# EAGLE design Composite Board (EAGLE 9.1.3)
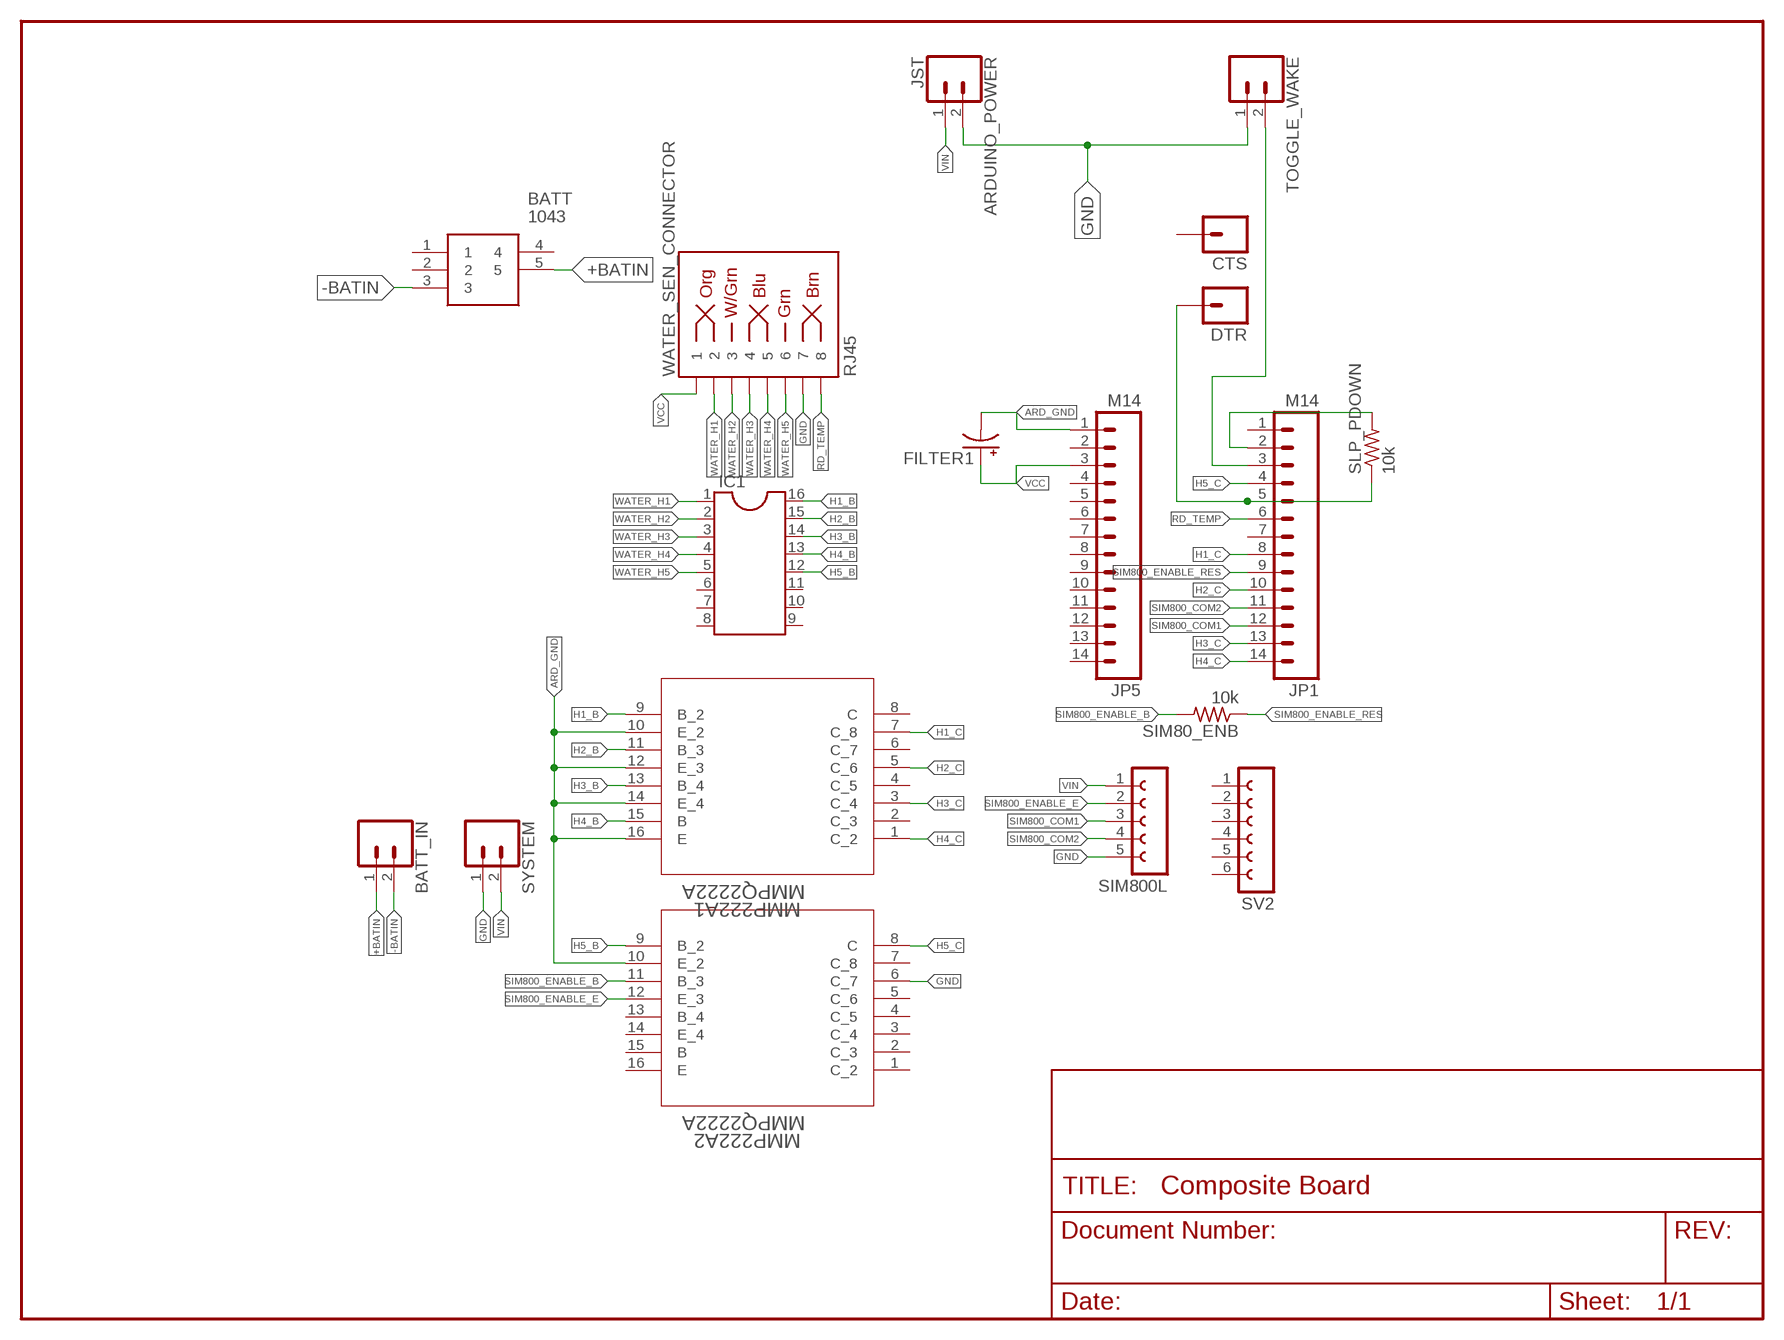
[diagram p0: schematic, sheet 1]

## Parts
ARDUINO_POWER  JST  CONN_02  [1X02]
BATT  1043  [1043]
BATT_IN  CONN_02  [1X02]
CTS  M01PTH  [1X01]
DTR  M01PTH  [1X01]
FILTER1  CPOL-USE2.5-5  [E2,5-5]
IC1  DIL16S  [SOCKET-16]
JP1  M14  [1X14]
JP5  M14  [1X14]
MMP222A1  MMPQ2222A  [SO-G16]
MMP222A2  MMPQ2222A  [SO-G16]
SIM80_ENB  10k  R-US_0204/5  [0204/5]
SIM800L  FE05-1  [FE05-1]
SLP_PDOWN  10k  R-US_0204/5  [0204/5]
SV2  FE06-1  [FE06]
SYSTEM  CONN_02  [1X02]
TOGGLE_WAKE  CONN_02  [1X02]
WATER_SEN_CONNECTOR  RJ45  RJ45-8  [RJ45-8]

## Nets
+BATIN: BATT.5 BATT_IN.1
-BATIN: BATT.3 BATT_IN.2
ARD_GND: FILTER1.- JP5.1 MMP222A1.10(E_2) MMP222A1.12(E_3) MMP222A1.14(E_4) MMP222A1.16(E) MMP222A2.10(E_2)
GND: ARDUINO_POWER.2 MMP222A2.6(C_7) SIM800L.5 SYSTEM.1 TOGGLE_WAKE.1 WATER_SEN_CONNECTOR.7
H1_B: IC1.16 MMP222A1.9(B_2)
H1_C: JP1.8 MMP222A1.7(C_8)
H2_B: IC1.15 MMP222A1.11(B_3)
H2_C: JP1.10 MMP222A1.5(C_6)
H3_B: IC1.14 MMP222A1.13(B_4)
H3_C: JP1.13 MMP222A1.3(C_4)
H4_B: IC1.13 MMP222A1.15(B)
H4_C: JP1.14 MMP222A1.1(C_2)
H5_B: IC1.12 MMP222A2.9(B_2)
H5_C: JP1.4 MMP222A2.8(C)
N$22: DTR.1 JP1.5 SLP_PDOWN.1
N$23: JP1.2 SLP_PDOWN.2
N$30: JP1.3 TOGGLE_WAKE.2
RD_TEMP: JP1.6 WATER_SEN_CONNECTOR.8
SIM800_COM1: JP1.12 SIM800L.3
SIM800_COM2: JP1.11 SIM800L.4
SIM800_ENABLE_B: MMP222A2.11(B_3) SIM80_ENB.2
SIM800_ENABLE_E: MMP222A2.12(E_3) SIM800L.2
SIM800_ENABLE_RES: JP1.9 SIM80_ENB.1
VCC: FILTER1.+ JP5.3 WATER_SEN_CONNECTOR.1
VIN: ARDUINO_POWER.1 SIM800L.1 SYSTEM.2
WATER_H1: IC1.1 WATER_SEN_CONNECTOR.2
WATER_H2: IC1.2 WATER_SEN_CONNECTOR.3
WATER_H3: IC1.3 WATER_SEN_CONNECTOR.4
WATER_H4: IC1.4 WATER_SEN_CONNECTOR.5
WATER_H5: IC1.5 WATER_SEN_CONNECTOR.6
Unconnected: BATT.1 BATT.2 BATT.4 CTS.1 IC1.6 IC1.7 IC1.8 IC1.9 IC1.10 IC1.11 JP1.1 JP1.7 JP5.2 JP5.4 JP5.5 JP5.6 JP5.7 JP5.8 JP5.9 JP5.10 JP5.11 JP5.12 JP5.13 JP5.14 MMP222A1.2(C_3) MMP222A1.4(C_5) MMP222A1.6(C_7) MMP222A1.8(C) MMP222A2.1(C_2) MMP222A2.2(C_3) MMP222A2.3(C_4) MMP222A2.4(C_5) MMP222A2.5(C_6) MMP222A2.7(C_8) MMP222A2.13(B_4) MMP222A2.14(E_4) MMP222A2.15(B) MMP222A2.16(E) SV2.1 SV2.2 SV2.3 SV2.4 SV2.5 SV2.6

## Library data of the parts
ARDUINO_POWER BATT_IN SYSTEM TOGGLE_WAKE = SparkFun-Connectors:CONN_02: Multi connection point. Often used as Generic Header-pin footprint for 0.1 inch spaced/style header connections On any of the 0.1 inch spaced packages, you can populate with these: Break Away Headers - Straight <https://www.sparkfun.com/products/116> (PRT-00116) Break Away Male Headers - Right Angle <https://www.sparkfun.com/products/553> (PRT-00553) Female Headers <https://www.sparkfun.com/products/115> (PRT-00115) Break Away Headers - Machine Pin <https://www.sparkfun.com/products/117> (PRT-00117) Break Away Female Headers - Swiss Machine Pin <https://www.sparkfun.com/products/743> (PRT-00743) For SCREWTERMINALS and SPRING TERMINALS visit here: Screw Terimnals on SparkFun.com <https://www.sparkfun.com/search/results?term=Screw+Terminals> (5mm/3.5mm/2.54mm spacing) This device is also useful as a general connection point to wire up your design to another part of your project. Our various solder wires solder well into these plated through hole pads. Hook-Up Wire - Assortment (Stranded, 22 AWG) <https://www.sparkfun.com/products/11375> (PRT-11375) Hook-Up Wire - Assortment (Solid Core, 22 AWG) <https://www.sparkfun.com/products/11367> (PRT-11367) View the entire wire category on our website here <https://www.sparkfun.com/categories/141> Special notes: Molex polarized connector foot print use with: PRT-08233 with associated crimp pins and housings. 2.54_SCREWTERM for use with PRT-10571. 3.5mm Screw Terminal footprints for PRT-08084 5mm Screw Terminal footprints for use with PRT-08432
BATT = SamacSys_Parts:1043: KEYSTONE - 1043 - BATTERY HOLDER, 18650, TH Source: Datasheet <http://www.keyelco.com/product-pdf.cfm?p=919>; ALLIED_NUMBER: 70182389; ALLIED_PRICE-STOCK: https://www.alliedelec.com/keystone-electronics-1043/70182389/; DESCRIPTION: KEYSTONE - 1043 - BATTERY HOLDER, 18650, TH; HEIGHT: mm; MANUFACTURER_NAME: Keystone Electronics; MANUFACTURER_PART_NUMBER: 1043; MOUSER_PART_NUMBER: 534-1043; MOUSER_PRICE-STOCK: https://www.mouser.com/Search/Refine.aspx?Keyword=534-1043
CTS DTR = SparkFun:M01: Header 1 Standard 1-pin 0.1" header. Use with straight break away headers (SKU : PRT-00116), right angle break away headers (PRT-00553), swiss pins (PRT-00743), machine pins (PRT-00117), and female headers (PRT-00115).
FILTER1 = rcl:CPOL-US: POLARIZED CAPACITOR, American symbol; SPICEPREFIX: C
IC1 = ic-package:DIL16: Dual In Line / Socket
JP1 JP5 = SparkFun:M14: Header 14 Standard 14-pin 0.1" header. Use with straight break away headers (SKU : PRT-00116), right angle break away headers (PRT-00553), swiss pins (PRT-00743), machine pins (PRT-00117), and female headers (PRT-00115).
MMP222A1 MMP222A2 = 2222a Array:MMPQ2222A; MANUFACTURER_PART_NUMBER: MMPQ2222A; VENDOR: Motorola
SIM80_ENB SLP_PDOWN = rcl:R-US_: RESISTOR, American symbol; SPICEPREFIX: R
SIM800L = con-lsta:FE05-1: FEMALE HEADER; OC_FARNELL: unknown; OC_NEWARK: unknown
SV2 = con-lsta:FE06-1: FEMALE HEADER; OC_FARNELL: unknown; OC_NEWARK: unknown
WATER_SEN_CONNECTOR = SparkFun-Connectors:RJ45-8: RJ45 Jack - 8 pin Simple RJ45, 8-pin connection. Commonly used for Cat5, Cat5e, and Cat6 Ethernet cables. Here is the connector we sell at SparkFun: RJ45 8-Pin Connector <https://www.sparkfun.com/products/643> (PRT-00643) Datasheet <https://cdn.sparkfun.com/datasheets/Prototyping/04908.pdf> It is used on this SparkFun product: SparkFun RJ45 Breakout <https://www.sparkfun.com/products/716> (BOB-00716) Note, you may also be interested in the "MAGJACK" version of this. It is basically a RJ45 connector, but also has some status LEDs built into the connector housing. You can check that out in this library at the device named "MAGJACK.dev" and see these products online: RJ45 Ethernet MagJack-Compatible <https://www.sparkfun.com/products/8534> (PRT-08534) SparkFun RJ45 MagJack Breakout <https://www.sparkfun.com/products/13021> (BOB-13021); PROD_ID: CONN-08506; SF_ID: PRT-00643

## Net classes
0 Default: width 0.203 mm
1 VCC: width 0.381 mm
2 LEDPower: width 0.203 mm
3 ButtonSignal: width 0.203 mm

## Board
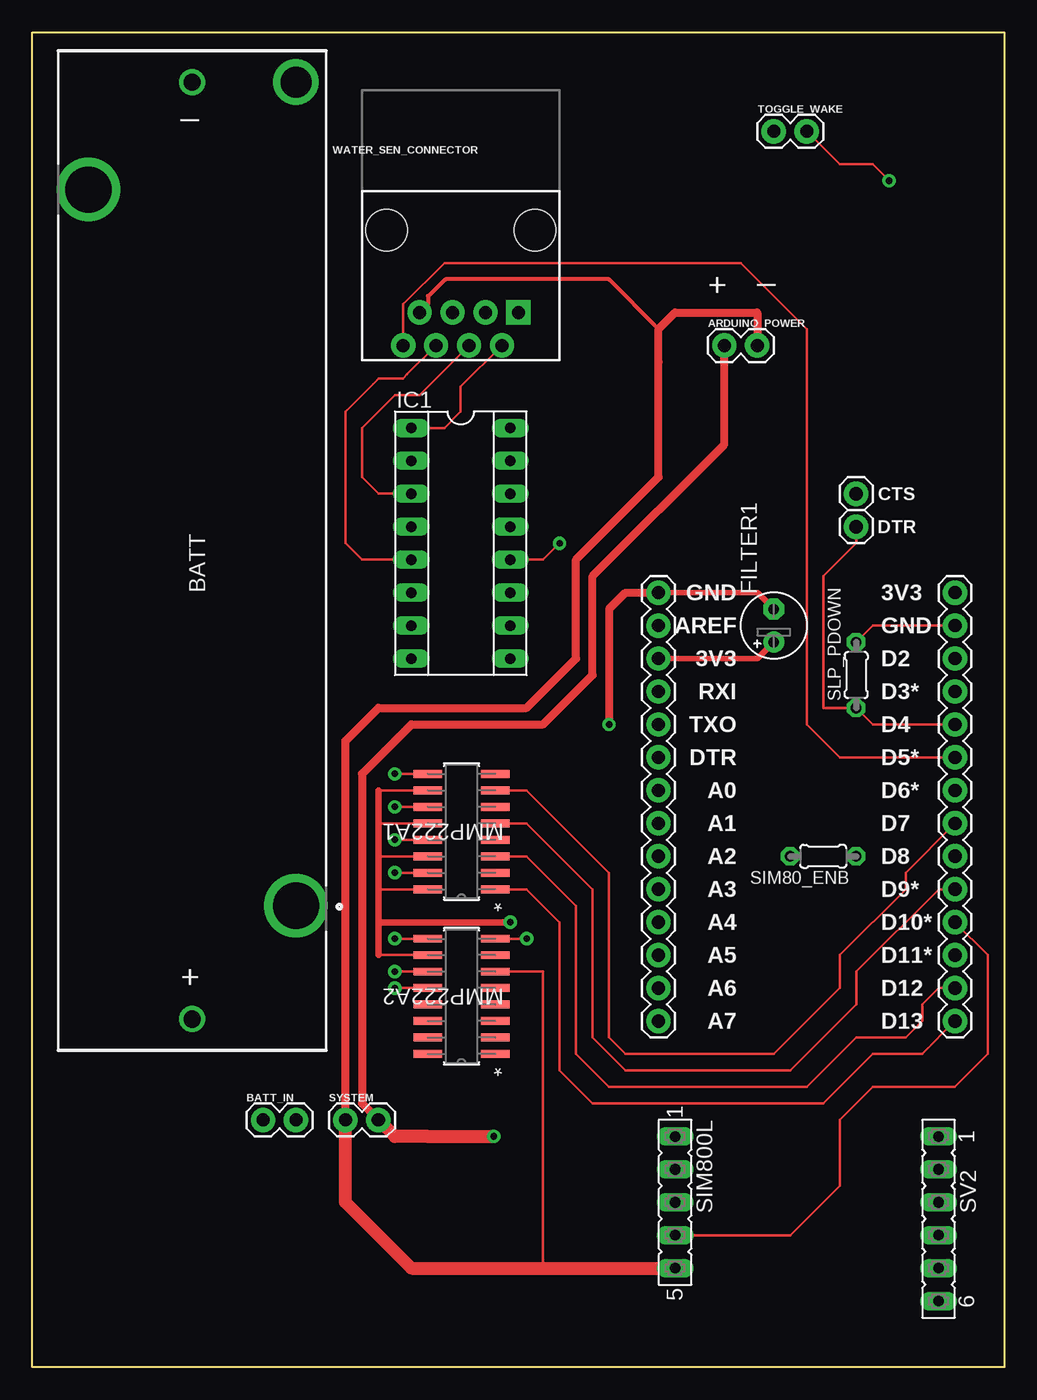
[diagram p1: board, top side]
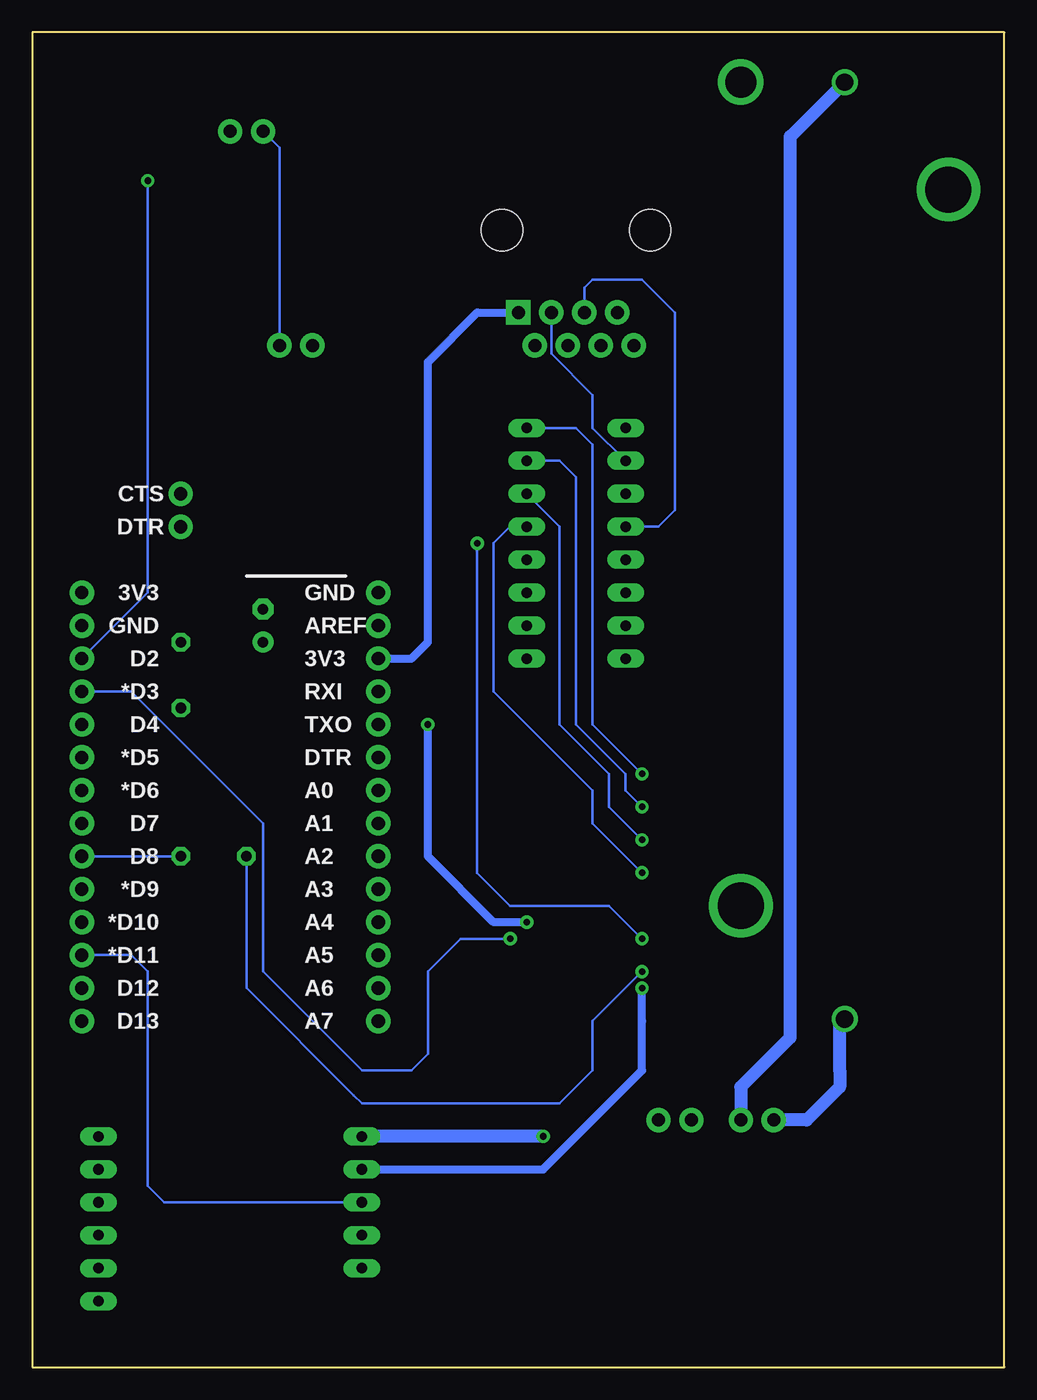
[diagram p2: board, bottom side, seen from below]

Size 74.93 x 102.87 mm. Coordinates in mm from the lower left corner, seen from the top.
Outline: 0,0 0,102.87 74.93,102.87 74.93,0 0,0
Copper layers (1*16): Top 0.035mm / dielectric 1.5mm / Bottom 0.035mm
Design rules "SparkFun": minimum track width 8mil, minimum drill 20mil, track to track 8mil, track to pad 8mil, pad to pad 8mil, via to via 8mil, smd to smd 8mil, copper to edge 8mil, drill to drill 8mil, minimum pad ring 12mil, minimum via ring 10mil, stop-mask expansion 4mil, vias tented up to drill 20mil, thermal gap 10mil

### Footprints (pad centres in the part's own frame; a part is rotated, then mirrored left to right if it is on the bottom)
1X02 = drill 1.016 pad 1.88: 1 0,0; 2 2.54,0
1043 = drill 3.55 pad 4.9: 1 0,0; 4 55.2,16 | drill 2.39 pad 3.5: 2 63.48,0 | drill 1.32 pad 2: 3 63.48,8; 5 -8.74,8
1X01 = drill 1.016 pad 1.88: 1 0,0
E2,5-5 = drill 0.813 pad 1.6: + -1.27,0 | drill 0.813 pad 1.6 octagon: - 1.27,0
SOCKET-16 = drill 0.813 long: 1 -8.89,-3.81; 2 -6.35,-3.81; 3 -3.81,-3.81; 4 -1.27,-3.81; 5 1.27,-3.81; 6 3.81,-3.81; 7 6.35,-3.81; 8 8.89,-3.81; 9 8.89,3.81; 10 6.35,3.81; 11 3.81,3.81; 12 1.27,3.81; 13 -1.27,3.81; 14 -3.81,3.81; 15 -6.35,3.81; 16 -8.89,3.81
1X14 = drill 1.016 pad 1.88: 1 0,0; 2 2.54,0; 3 5.08,0; 4 7.62,0; 5 10.16,0; 6 12.7,0; 7 15.24,0; 8 17.78,0; 9 20.32,0; 10 22.86,0; 11 25.4,0; 12 27.94,0; 13 30.48,0; 14 33.02,0
SO-G16 = smd 2.21 x 0.61: 1 -5.199,8.89; 2 -5.199,7.62; 3 -5.199,6.35; 4 -5.199,5.08; 5 -5.199,3.81; 6 -5.199,2.54; 7 -5.199,1.27; 8 -5.199,0; 9 0,0; 10 0,1.27; 11 0,2.54; 12 0,3.81; 13 0,5.08; 14 0,6.35; 15 0,7.62; 16 0,8.89
0204/5 = drill 0.813 octagon: 1 -2.54,0; 2 2.54,0
FE05-1 = drill 0.813 long: 1 -5.08,0; 2 -2.54,0; 3 0,0; 4 2.54,0; 5 5.08,0
FE06 = drill 0.813 long: 1 -6.35,0; 2 -3.81,0; 3 -1.27,0; 4 1.27,0; 5 3.81,0; 6 6.35,0
RJ45-8 = drill 1 pad 1.88 square: 1 -4.445,6.35 | drill 1 pad 1.88: 2 -3.175,8.89; 3 -1.905,6.35; 4 -0.635,8.89; 5 0.635,6.35; 6 1.905,8.89; 7 3.175,6.35; 8 4.445,8.89 | hole 3.2: -5.715,0; 5.715,0

### Placement (x,y rotation side)
ARDUINO_POWER  53.34,78.74 0 top
BATT  20.32,35.56 90 top
BATT_IN  17.78,19.05 0 top
CTS  63.5,67.31 0 top
DTR  63.5,64.77 0 top
FILTER1  57.15,57.15 90 top
IC1  33.02,63.5 270 top
JP1  71.12,59.69 270 top
JP5  48.26,59.69 270 top
MMP222A1  30.48,45.72 180 top
MMP222A2  30.48,33.02 180 top
SIM80_ENB  60.96,39.37 180 top
SIM800L  49.53,12.7 270 top
SLP_PDOWN  63.5,53.34 90 top
SV2  69.85,11.43 270 top
SYSTEM  24.13,19.05 0 top
TOGGLE_WAKE  57.15,95.25 0 top
WATER_SEN_CONNECTOR  33.02,87.63 180 top

### Tracks (layer width: path | path; a pad name or v marks a point on that pad's centre or on a via)
+BATIN
  Bottom 0.203: 12.7,26.44 BATT.5
  Bottom 1.016: BATT_IN.1 15.24,19.05 12.7,21.59 12.7,22.86 12.7,25.17 12.7,26.44
-BATIN
  Bottom 1.016: BATT.3 16.51,94.85 16.51,27.94 16.51,25.4 20.32,21.59 BATT_IN.2
ARD_GND  (via drill 0.51)
  Top 0.203: MMP222A2.10 26.67,31.75 | 26.67,41.91 MMP222A1.12 | MMP222A1.10 26.67,44.45 | MMP222A1.14 26.67,39.37 | MMP222A1.16 26.67,36.83 | 33.02,34.29 31.75,34.29
  Top 0.406: FILTER1.- 55.88,59.69 54.61,59.69 JP5.1
  Top 0.508: 26.67,31.75 26.67,34.29 | 26.67,34.29 26.67,36.83 26.67,39.37 26.67,41.91 26.67,44.45 | 26.67,34.29 33.02,34.29 | 31.75,34.29 v36.83,34.29
  Top 0.61: v44.45,49.53 44.45,58.42 45.72,59.69 JP5.1
  Bottom 0.61: v36.83,34.29 39.37,34.29 44.45,39.37 v44.45,49.53
GND
  Top 0.203: 39.37,7.62 39.37,30.48 MMP222A2.6
  Top 0.305: 48.26,80.01 44.42,83.84 31.85,83.84 30.55,82.55 30.48,82.55 30.48,81.92 WATER_SEN_CONNECTOR.7
  Top 0.61: ARDUINO_POWER.2 55.88,81.28 49.53,81.28 48.26,80.01 48.26,77.47 48.26,68.58 41.91,62.23 41.91,54.61 38.1,50.8 26.67,50.8 24.13,48.26 SYSTEM.1
  Top 1.016: SIM800L.5 39.37,7.62 29.21,7.62 24.13,12.7 SYSTEM.1
  Bottom 0.203: TOGGLE_WAKE.1 55.88,93.98 ARDUINO_POWER.2
H1_B  (via drill 0.51)
  Top 0.203: MMP222A1.9 v27.94,45.72
  Bottom 0.203: v27.94,45.72 31.75,49.53 31.75,71.12 33.02,72.39 IC1.16
H1_C
  Top 0.203: JP1.8 67.31,38.1 67.31,36.83 62.23,31.75 62.23,29.21 57.15,24.13 45.72,24.13 44.45,25.4 44.45,38.1 38.1,44.45 MMP222A1.7
H2_B  (via drill 0.51)
  Top 0.203: MMP222A1.11 v27.94,43.18
  Bottom 0.203: v27.94,43.18 29.21,44.45 29.21,45.72 33.02,49.53 33.02,68.58 34.29,69.85 IC1.15
H2_C
  Top 0.203: MMP222A1.5 38.1,41.91 43.18,36.83 43.18,25.4 45.72,22.86 58.42,22.86 63.5,27.94 63.5,30.48 69.85,36.83 JP1.10
H3_B  (via drill 0.51)
  Top 0.203: MMP222A1.13 v27.94,40.64
  Bottom 0.203: v27.94,40.64 30.48,43.18 30.48,45.72 34.29,49.53 34.29,64.77 IC1.14
H3_C
  Top 0.203: JP1.13 69.85,29.21 68.58,27.94 68.58,26.67 67.31,25.4 63.5,25.4 59.69,21.59 44.45,21.59 41.91,24.13 41.91,35.56 38.1,39.37 MMP222A1.3
H4_B  (via drill 0.51)
  Top 0.203: MMP222A1.15 v27.94,38.1
  Bottom 0.203: v27.94,38.1 31.75,41.91 31.75,44.45 39.37,52.07 39.37,63.5 38.1,64.77 IC1.13
H4_C
  Top 0.203: MMP222A1.1 38.1,36.83 40.64,34.29 40.64,22.86 43.18,20.32 60.96,20.32 64.77,24.13 68.58,24.13 JP1.14
H5_B  (via drill 0.51)
  Top 0.203: MMP222A2.9 v27.94,33.02 | v40.64,63.5 39.37,62.23 IC1.12
  Bottom 0.203: v27.94,33.02 30.48,35.56 38.1,35.56 40.64,38.1 v40.64,63.5
H5_C  (via drill 0.51)
  Top 0.203: v38.1,33.02 MMP222A2.8
  Bottom 0.203: v38.1,33.02 41.91,33.02 44.45,30.48 44.45,24.13 45.72,22.86 49.53,22.86 57.15,30.48 57.15,41.91 67.31,52.07 JP1.4
N$22
  Top 0.203: JP1.5 64.77,49.53 SLP_PDOWN.1 60.96,50.8 60.96,60.96 63.5,63.5 DTR.1
N$23
  Top 0.203: SLP_PDOWN.2 64.77,57.15 JP1.2
N$30  (via drill 0.51)
  Top 0.203: TOGGLE_WAKE.2 62.23,92.71 64.77,92.71 v66.04,91.44
  Bottom 0.203: v66.04,91.44 66.04,59.69 JP1.3
RD_TEMP
  Top 0.203: JP1.6 62.23,46.99 59.69,49.53 59.69,80.01 54.61,85.09 31.75,85.09 28.57,81.92 WATER_SEN_CONNECTOR.8
SIM800_COM1
  Bottom 0.203: SIM800L.3 64.77,12.7 66.04,13.97 66.04,30.48 67.31,31.75 JP1.12
SIM800_COM2
  Top 0.203: SIM800L.4 58.42,10.16 62.23,13.97 62.23,19.05 64.77,21.59 71.12,21.59 73.66,24.13 73.66,31.75 JP1.11
SIM800_ENABLE_B  (via drill 0.51)
  Top 0.203: v27.94,30.48 MMP222A2.11
  Bottom 0.203: SIM80_ENB.2 58.42,29.21 50.16,20.95 49.53,20.32 34.29,20.32 31.75,22.86 31.75,26.67 v27.94,30.48
SIM800_ENABLE_E  (via drill 0.51)
  Top 0.203: v27.94,29.21 MMP222A2.12
  Bottom 0.61: SIM800L.2 35.56,15.24 27.94,22.86 27.94,26.67 v27.94,29.21
SIM800_ENABLE_RES
  Bottom 0.203: SIM80_ENB.1 JP1.9
VCC
  Top 0.406: FILTER1.+ 55.88,54.61 JP5.3
  Bottom 0.61: JP5.3 45.72,54.61 44.45,55.88 44.45,77.47 40.64,81.28 WATER_SEN_CONNECTOR.1
VIN  (via drill 0.51)
  Top 0.203: 30.48,17.78 | 30.48,17.78
  Top 0.61: ARDUINO_POWER.1 53.34,71.12 43.18,60.96 43.18,53.34 39.37,49.53 29.21,49.53 25.4,45.72 25.4,20.32 SYSTEM.2
  Top 1.016: v35.56,17.78 30.48,17.78 27.94,17.78 SYSTEM.2
  Bottom 1.016: v35.56,17.78 SIM800L.1
WATER_H1
  Top 0.203: IC1.1 31.75,72.39 33.02,73.66 33.02,75.56 WATER_SEN_CONNECTOR.2
WATER_H2
  Bottom 0.203: 34.92,81.92 WATER_SEN_CONNECTOR.3 34.92,78.11 31.75,74.93 31.75,72.39 IC1.2
WATER_H3
  Top 0.203: IC1.3 26.67,67.31 25.4,68.58 25.4,72.39 27.94,74.93 29.84,74.93 WATER_SEN_CONNECTOR.4
WATER_H4
  Bottom 0.203: IC1.4 26.67,64.77 25.4,66.04 25.4,81.28 27.94,83.82 31.75,83.82 32.38,83.19 WATER_SEN_CONNECTOR.5
WATER_H5
  Top 0.203: IC1.5 25.4,62.23 24.13,63.5 24.13,73.66 26.67,76.2 28.57,76.2 28.89,76.52 WATER_SEN_CONNECTOR.6

### Text on the board
tPlace: CTS | DTR | GND | 3V3 | AREF | GND | 3V3 | D2 | RXI | D3* | TXO | D4 | DTR | D5* | A0 | D6* | A1 | D7 | A2 | D8 | A3 | D9* | A4 | D10* | A5 | D11* | A6 | D12 | A7 | D13
bPlace: CTS | DTR | 3V3 | GND | GND | AREF | D2 | 3V3 | *D3 | RXI | D4 | TXO | *D5 | DTR | *D6 | A0 | D7 | A1 | D8 | A2 | *D9 | A3 | *D10 | A4 | *D11 | A5 | D12 | A6 | D13 | A7
tSilk: DROP V3 / JACOB DICE
_tsilk: _ | _ | + | +